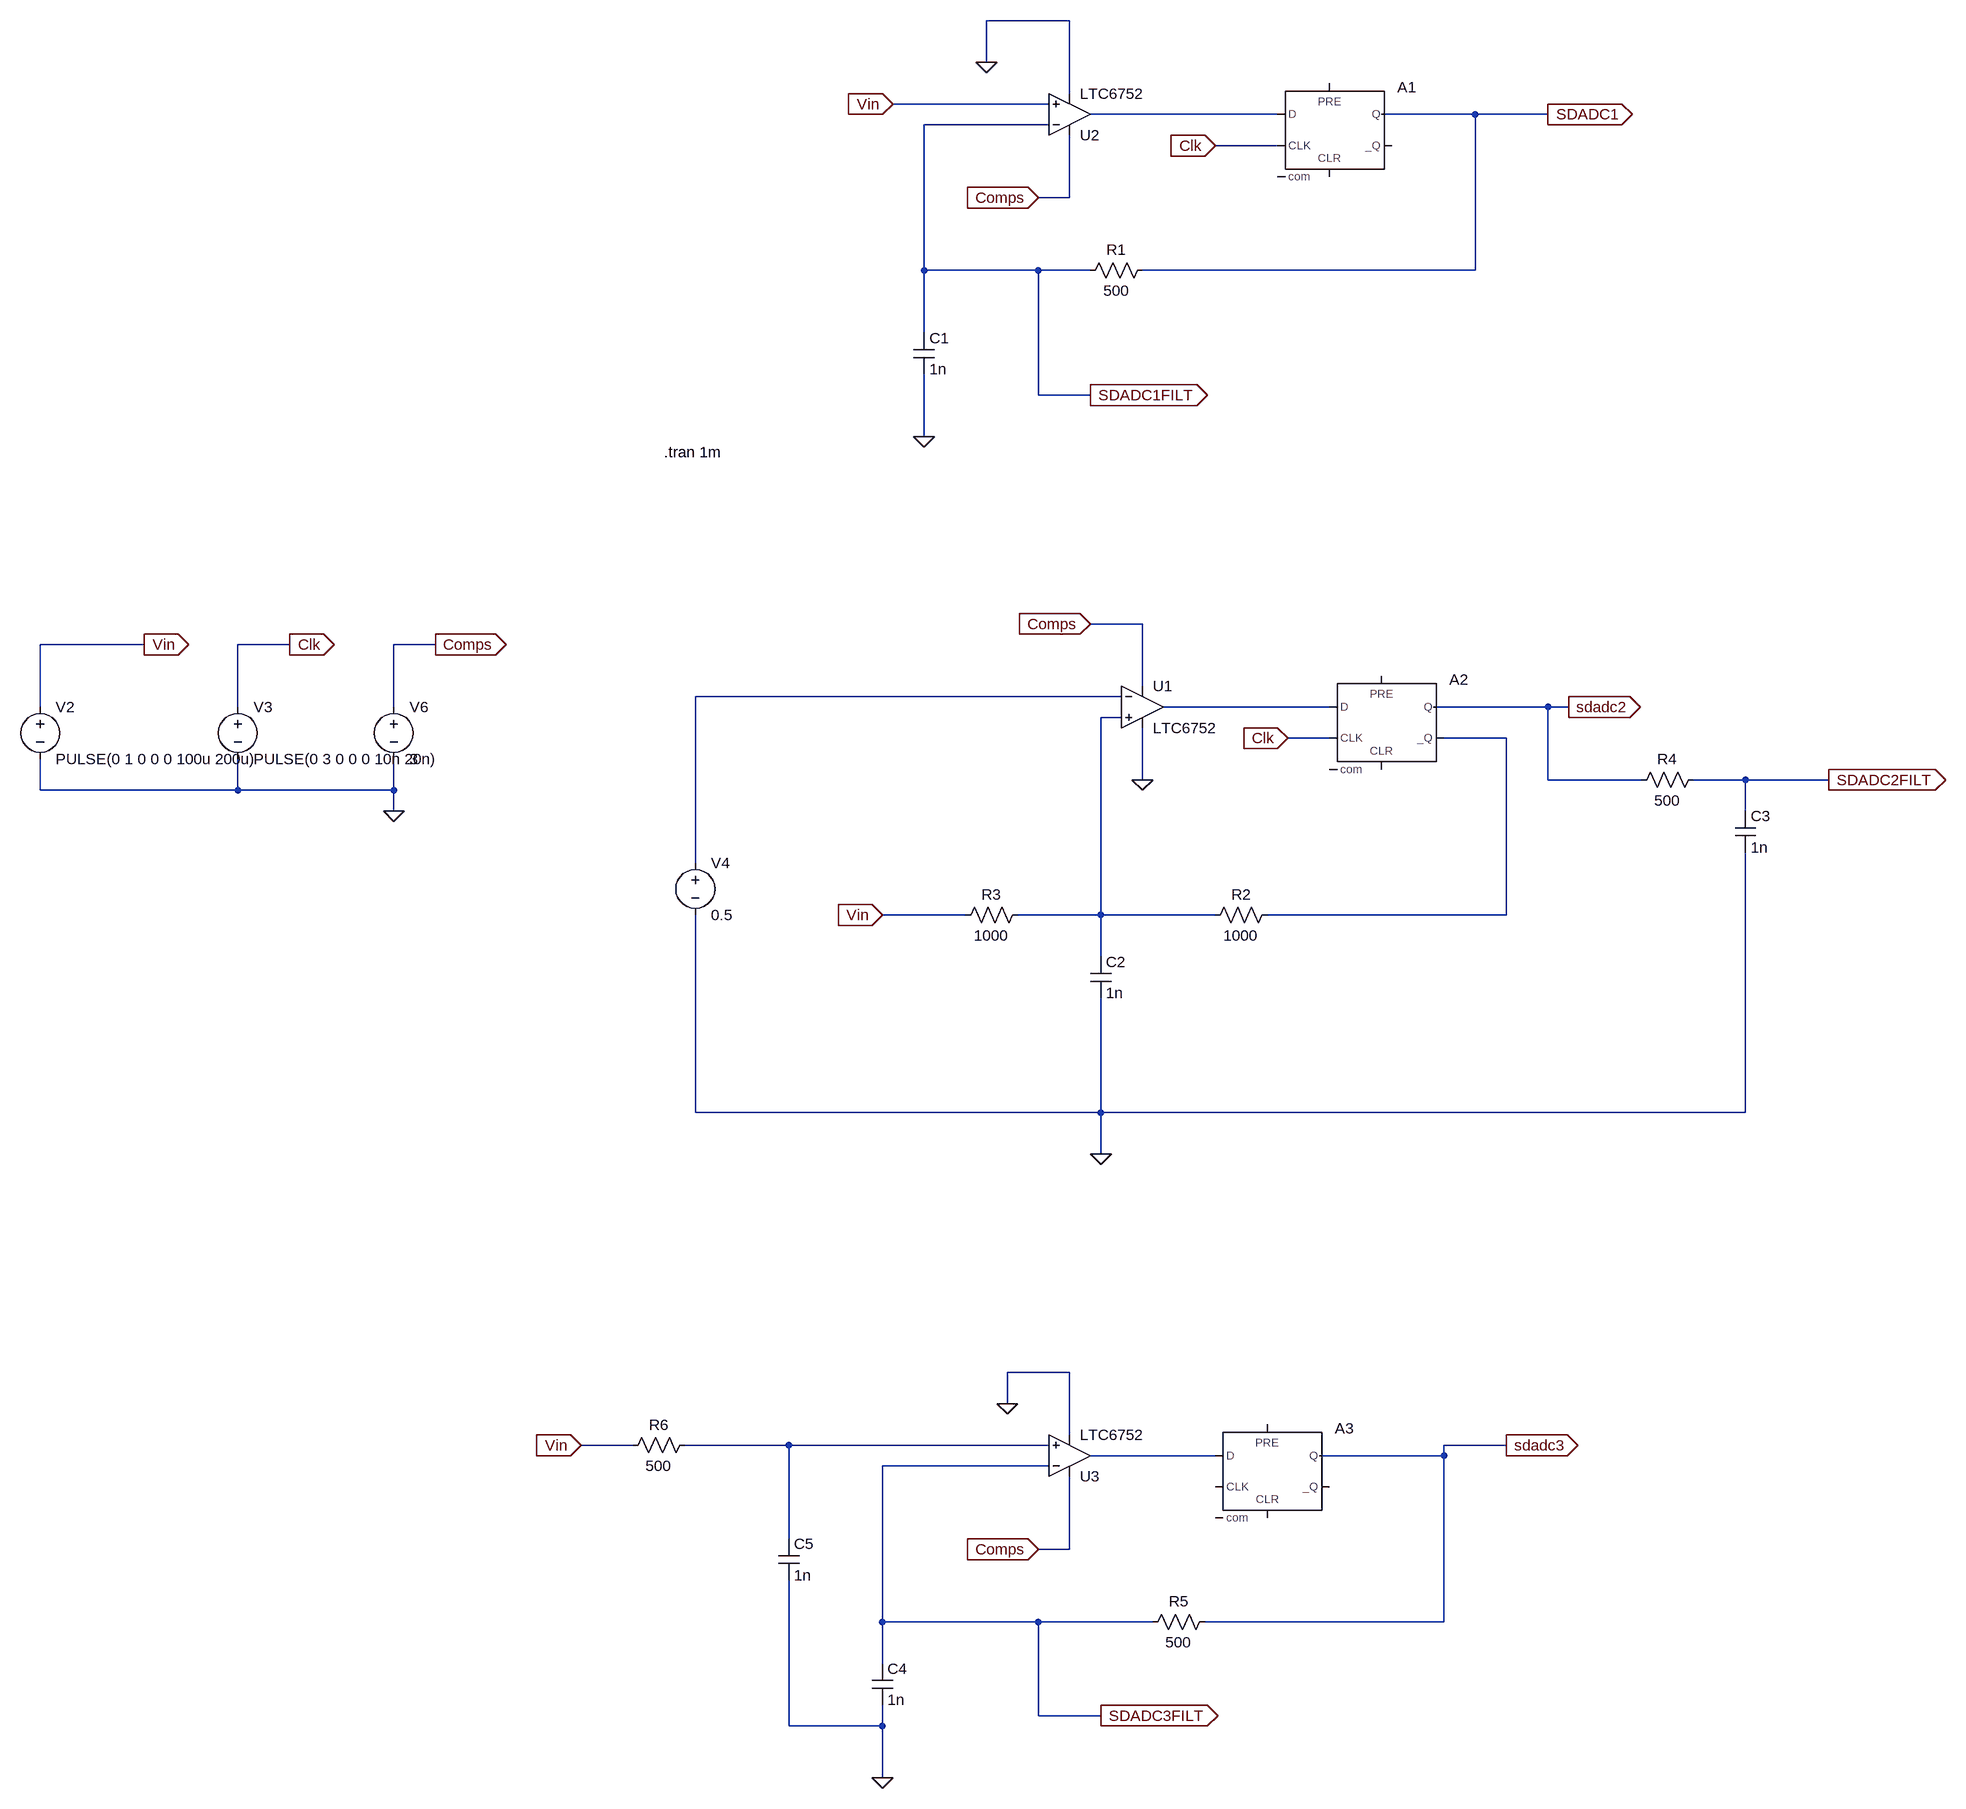
[diagram p0: schematic sigmadelta test.asc]
sigmadelta test.asc, the LTspice schematic file:
Version 4
SHEET 1 1336 2676
WIRE -224 -48 -352 -48
WIRE -352 16 -352 -48
WIRE -224 64 -224 -48
WIRE -256 80 -496 80
WIRE 96 96 -192 96
WIRE 400 96 256 96
WIRE 512 96 400 96
WIRE -256 112 -448 112
WIRE 96 144 0 144
WIRE -224 224 -224 128
WIRE -224 224 -272 224
WIRE -448 336 -448 112
WIRE -272 336 -448 336
WIRE -192 336 -272 336
WIRE 400 336 400 96
WIRE 400 336 -112 336
WIRE -448 432 -448 336
WIRE -272 528 -272 336
WIRE -192 528 -272 528
WIRE -448 592 -448 496
WIRE -112 880 -192 880
WIRE -1648 912 -1808 912
WIRE -1424 912 -1504 912
WIRE -1200 912 -1264 912
WIRE -112 976 -112 880
WIRE -144 992 -800 992
WIRE -1808 1008 -1808 912
WIRE -1504 1008 -1504 912
WIRE -1264 1008 -1264 912
WIRE 176 1008 -80 1008
WIRE 512 1008 336 1008
WIRE 544 1008 512 1008
WIRE -144 1024 -176 1024
WIRE 176 1056 112 1056
WIRE 448 1056 352 1056
WIRE -112 1120 -112 1040
WIRE 512 1120 512 1008
WIRE 656 1120 512 1120
WIRE 816 1120 736 1120
WIRE 944 1120 816 1120
WIRE -1808 1136 -1808 1088
WIRE -1504 1136 -1504 1088
WIRE -1504 1136 -1808 1136
WIRE -1264 1136 -1264 1088
WIRE -1264 1136 -1504 1136
WIRE -1264 1168 -1264 1136
WIRE 816 1168 816 1120
WIRE -800 1248 -800 992
WIRE -384 1328 -512 1328
WIRE -176 1328 -176 1024
WIRE -176 1328 -304 1328
WIRE 0 1328 -176 1328
WIRE 448 1328 448 1056
WIRE 448 1328 80 1328
WIRE -176 1392 -176 1328
WIRE -800 1632 -800 1328
WIRE -176 1632 -176 1456
WIRE -176 1632 -800 1632
WIRE 816 1632 816 1232
WIRE 816 1632 -176 1632
WIRE -176 1696 -176 1632
WIRE -224 2032 -320 2032
WIRE -320 2080 -320 2032
WIRE -224 2128 -224 2032
WIRE -896 2144 -976 2144
WIRE -656 2144 -816 2144
WIRE -256 2144 -656 2144
WIRE 448 2144 352 2144
WIRE 0 2160 -192 2160
WIRE 352 2160 352 2144
WIRE 352 2160 160 2160
WIRE -256 2176 -512 2176
WIRE -656 2288 -656 2144
WIRE -224 2304 -224 2192
WIRE -224 2304 -272 2304
WIRE -512 2416 -512 2176
WIRE -272 2416 -512 2416
WIRE -96 2416 -272 2416
WIRE 352 2416 352 2160
WIRE 352 2416 -16 2416
WIRE -512 2480 -512 2416
WIRE -272 2560 -272 2416
WIRE -176 2560 -272 2560
WIRE -656 2576 -656 2352
WIRE -512 2576 -512 2544
WIRE -512 2576 -656 2576
WIRE -512 2656 -512 2576
FLAG -448 592 0
FLAG 512 96 SDADC1
IOPIN 512 96 Out
FLAG -352 16 0
FLAG -176 1696 0
FLAG 544 1008 sdadc2
IOPIN 544 1008 Out
FLAG -1200 912 Comps
IOPIN -1200 912 Out
FLAG -1264 1168 0
FLAG -272 224 Comps
IOPIN -272 224 In
FLAG -192 880 Comps
IOPIN -192 880 In
FLAG -112 1120 0
FLAG -1424 912 Clk
IOPIN -1424 912 Out
FLAG 0 144 Clk
IOPIN 0 144 In
FLAG 112 1056 Clk
IOPIN 112 1056 In
FLAG -1648 912 Vin
IOPIN -1648 912 Out
FLAG -496 80 Vin
IOPIN -496 80 In
FLAG -512 1328 Vin
IOPIN -512 1328 In
FLAG -512 2656 0
FLAG -272 2304 Comps
IOPIN -272 2304 In
FLAG -320 2080 0
FLAG -976 2144 Vin
IOPIN -976 2144 In
FLAG 448 2144 sdadc3
IOPIN 448 2144 Out
FLAG 944 1120 SDADC2FILT
IOPIN 944 1120 Out
FLAG -176 2560 SDADC3FILT
IOPIN -176 2560 Out
FLAG -192 528 SDADC1FILT
IOPIN -192 528 Out
SYMBOL Digital\\dflop 176 48 R0
SYMATTR InstName A1
SYMBOL cap -464 432 R0
SYMATTR InstName C1
SYMATTR Value 1n
SYMBOL res -96 320 R90
WINDOW 0 0 56 VBottom 2
WINDOW 3 32 56 VTop 2
SYMATTR InstName R1
SYMATTR Value 500
SYMBOL voltage -1808 992 R0
WINDOW 123 0 0 Left 0
WINDOW 39 0 0 Left 0
SYMATTR InstName V2
SYMATTR Value PULSE(0 1 0 0 0 100u 200u)
SYMBOL Comparators\\LTC6752 -224 160 M180
SYMATTR InstName U2
SYMBOL Digital\\dflop 256 960 R0
SYMATTR InstName A2
SYMBOL voltage -800 1232 R0
WINDOW 123 0 0 Left 0
WINDOW 39 0 0 Left 0
SYMATTR InstName V4
SYMATTR Value 0.5
SYMBOL Comparators\\LTC6752 -112 944 R0
SYMATTR InstName U1
SYMBOL res 96 1312 R90
WINDOW 0 0 56 VBottom 2
WINDOW 3 32 56 VTop 2
SYMATTR InstName R2
SYMATTR Value 1000
SYMBOL res -288 1312 R90
WINDOW 0 0 56 VBottom 2
WINDOW 3 32 56 VTop 2
SYMATTR InstName R3
SYMATTR Value 1000
SYMBOL cap -192 1392 R0
SYMATTR InstName C2
SYMATTR Value 1n
SYMBOL voltage -1264 992 R0
WINDOW 123 0 0 Left 0
WINDOW 39 0 0 Left 0
SYMATTR InstName V6
SYMATTR Value 3
SYMBOL voltage -1504 992 R0
WINDOW 123 0 0 Left 0
WINDOW 39 0 0 Left 0
SYMATTR InstName V3
SYMATTR Value PULSE(0 3 0 0 0 10n 20n)
SYMBOL res 752 1104 R90
WINDOW 0 0 56 VBottom 2
WINDOW 3 32 56 VTop 2
SYMATTR InstName R4
SYMATTR Value 500
SYMBOL cap 800 1168 R0
SYMATTR InstName C3
SYMATTR Value 1n
SYMBOL Digital\\dflop 80 2112 R0
SYMATTR InstName A3
SYMBOL Comparators\\LTC6752 -224 2224 M180
SYMATTR InstName U3
SYMBOL res 0 2400 R90
WINDOW 0 0 56 VBottom 2
WINDOW 3 32 56 VTop 2
SYMATTR InstName R5
SYMATTR Value 500
SYMBOL cap -528 2480 R0
SYMATTR InstName C4
SYMATTR Value 1n
SYMBOL res -800 2128 R90
WINDOW 0 0 56 VBottom 2
WINDOW 3 32 56 VTop 2
SYMATTR InstName R6
SYMATTR Value 500
SYMBOL cap -672 2288 R0
SYMATTR InstName C5
SYMATTR Value 1n
TEXT -848 616 Left 2 !.tran 1m

The netlist it stands for:
* sigmadelta test.asc
A1 N001 0 Clk 0 0 0 SDADC1 0 DFLOP
C1 SDADC1FILT 0 1n
R1 SDADC1 SDADC1FILT 500
V2 Vin 0 PULSE(0 1 0 0 0 100u 200u)
XU2 Vin SDADC1FILT Comps 0 N001 LTC6752  ; pins In+ In- V+ V- OUT
A2 N003 0 Clk 0 0 N005 sdadc2 0 DFLOP
V4 N002 0 0.5
XU1 N004 N002 Comps 0 N003 LTC6752  ; pins In+ In- V+ V- OUT
R2 N005 N004 1000
R3 N004 Vin 1000
C2 N004 0 1n
V6 Comps 0 3
V3 Clk 0 PULSE(0 3 0 0 0 10n 20n)
R4 SDADC2FILT sdadc2 500
C3 SDADC2FILT 0 1n
A3 N007 0 0 0 0 0 sdadc3 0 DFLOP
XU3 N006 SDADC3FILT Comps 0 N007 LTC6752  ; pins In+ In- V+ V- OUT
R5 sdadc3 SDADC3FILT 500
C4 SDADC3FILT 0 1n
R6 N006 Vin 500
C5 N006 0 1n
.tran 1m
.lib LTC7.lib
.backanno
.end